# EAGLE design PCB-TLY-JACK-INTFC (EAGLE 6.4)
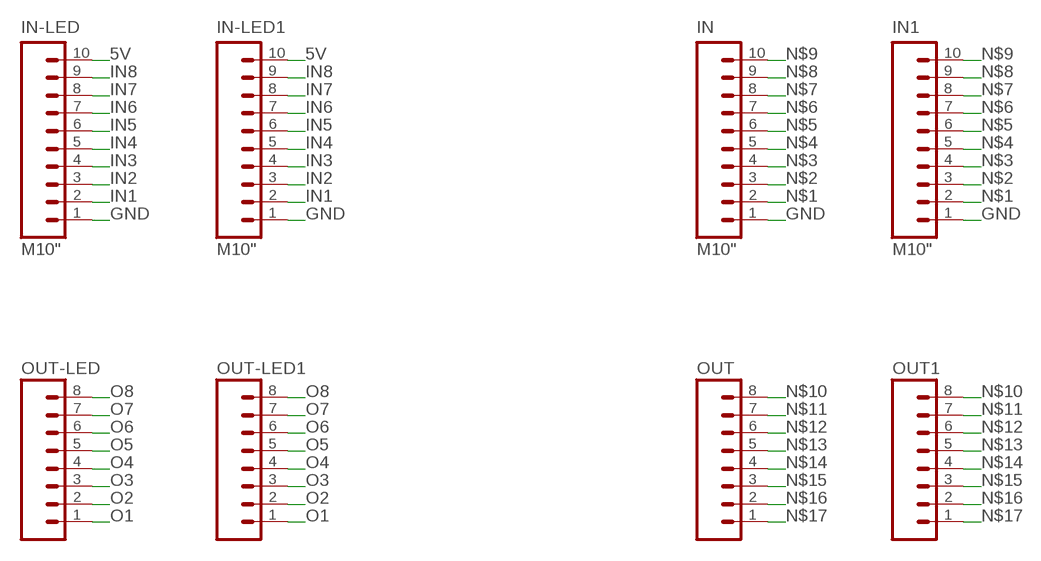
[diagram p0: schematic, sheet 1]

## Parts
IN  M10"  [1X10]
IN1  M10"  [1X10]
IN-LED  M10"  [1X10]
IN-LED1  M10"  [1X10]
OUT  M081X08  [1X08]
OUT1  M081X08  [1X08]
OUT-LED  M081X08  [1X08]
OUT-LED1  M081X08  [1X08]

## Nets
5V [Power]: IN-LED1.10 IN-LED.10
GND [Power]: IN1.1 IN-LED1.1 IN-LED.1 IN.1
IN1: IN-LED1.2 IN-LED.2
IN2: IN-LED1.3 IN-LED.3
IN3: IN-LED1.4 IN-LED.4
IN4: IN-LED1.5 IN-LED.5
IN5: IN-LED1.6 IN-LED.6
IN6: IN-LED1.7 IN-LED.7
IN7: IN-LED1.8 IN-LED.8
IN8: IN-LED1.9 IN-LED.9
N$1: IN1.2 IN.2
N$2: IN1.3 IN.3
N$3: IN1.4 IN.4
N$4: IN1.5 IN.5
N$5: IN1.6 IN.6
N$6: IN1.7 IN.7
N$7: IN1.8 IN.8
N$8: IN1.9 IN.9
N$9: IN1.10 IN.10
N$10: OUT1.8 OUT.8
N$11: OUT1.7 OUT.7
N$12: OUT1.6 OUT.6
N$13: OUT1.5 OUT.5
N$14: OUT1.4 OUT.4
N$15: OUT1.3 OUT.3
N$16: OUT1.2 OUT.2
N$17: OUT1.1 OUT.1
O1: OUT-LED1.1 OUT-LED.1
O2: OUT-LED1.2 OUT-LED.2
O3: OUT-LED1.3 OUT-LED.3
O4: OUT-LED1.4 OUT-LED.4
O5: OUT-LED1.5 OUT-LED.5
O6: OUT-LED1.6 OUT-LED.6
O7: OUT-LED1.7 OUT-LED.7
O8: OUT-LED1.8 OUT-LED.8

## Library data of the parts
IN IN1 IN-LED IN-LED1 = SparkFun:M10: Header 10 Standard 10-pin 0.1" header. Use with straight break away headers (SKU : PRT-00116), right angle break away headers (PRT-00553), swiss pins (PRT-00743), machine pins (PRT-00117), and female headers (PRT-00115).
OUT OUT1 OUT-LED OUT-LED1 = SparkFun:M08: Header 8 Standard 8-pin 0.1" header. Use with straight break away headers (SKU : PRT-00116), right angle break away headers (PRT-00553), swiss pins (PRT-00743), machine pins (PRT-00117), and female headers (PRT-00115).

## Net classes
0 default: width 0.203 mm, drill 0.406 mm, clearance 0.203 mm
1 Power: width 0.406 mm, drill 0.61 mm, clearance 0.203 mm
2 RELAY LINES: width 0.305 mm, drill 0.406 mm, clearance 0.254 mm
3 INput lines: width 0.203 mm, drill 0.406 mm, clearance 0.254 mm

## Board
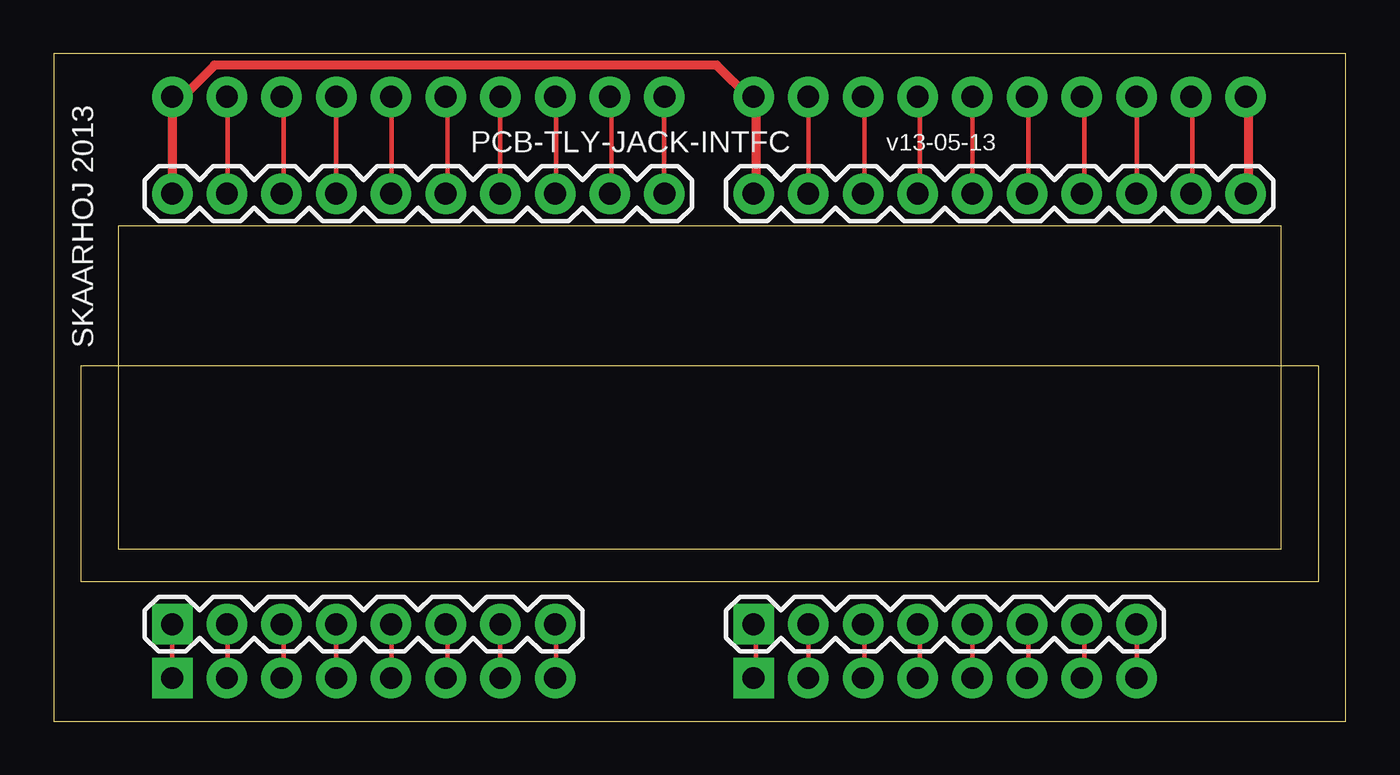
[diagram p1: board, top side]
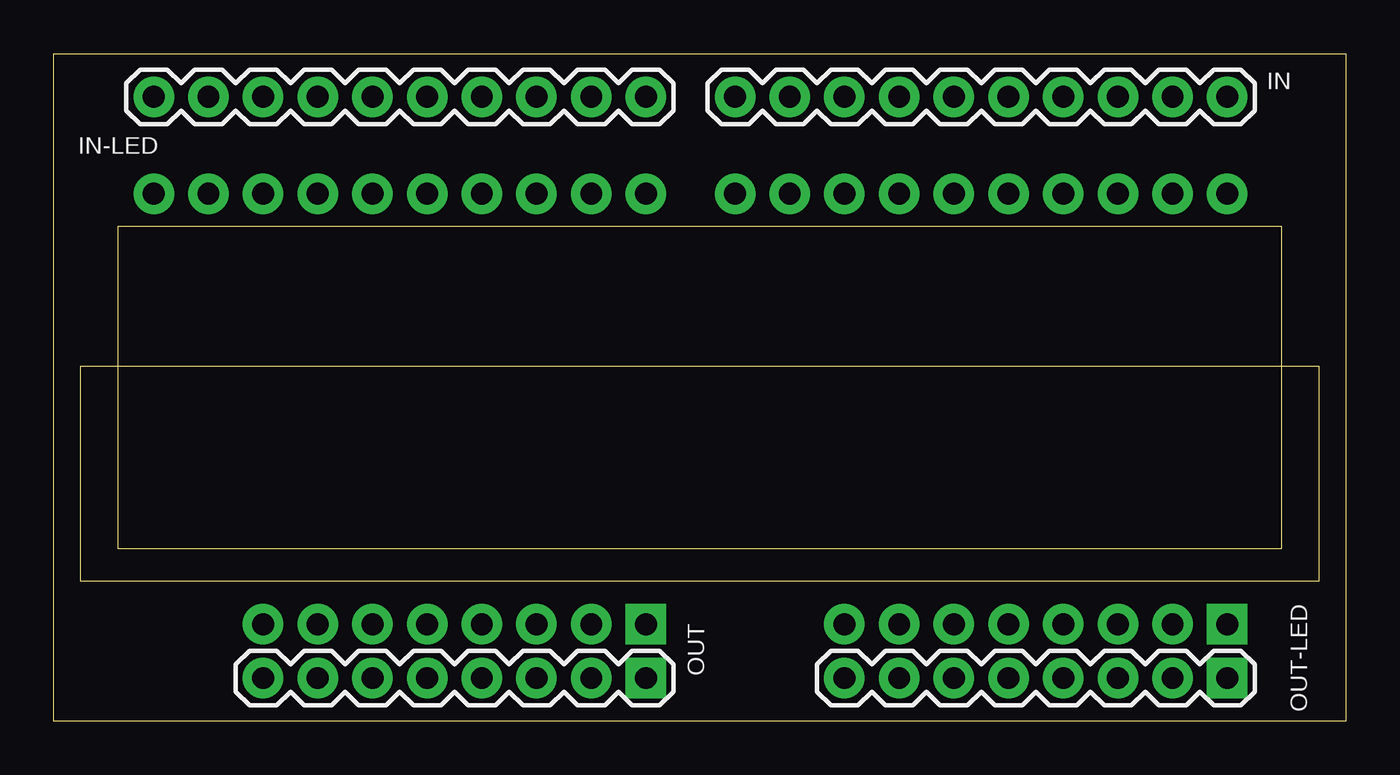
[diagram p2: board, bottom side, seen from below]

Size 60 x 31 mm. Coordinates in mm from the lower left corner, seen from the top.
Outline: 60,0 60,31 0,31 0,0 60,0
Copper layers (1*16): Top 0.035mm / dielectric 1.5mm / Bottom 0.035mm
Design rules "Fusion_eagle_rule_v1.1": minimum track width 6mil, minimum drill 12mil, track to track 6mil, track to pad 6mil, pad to pad 6mil, via to via 6mil, smd to smd 0mil, copper to edge 10mil, drill to drill 10mil, minimum pad ring 10mil, minimum via ring 6mil, stop-mask expansion 2mil, vias tented up to drill 100mil, thermal gap 10mil
tRestrict: area 2.7,7.7 to 57.3,23.3
bRestrict: area 2.7,7.7 to 57.3,23.3
Milling: area 3,8 to 57,23; area 1.2,6.5 to 58.8,16.5

### Footprints (pad centres in the part's own frame; a part is rotated, then mirrored left to right if it is on the bottom)
1X10 = drill 1.016 pad 1.88: 1 0,0; 2 2.54,0; 3 5.08,0; 4 7.62,0; 5 10.16,0; 6 12.7,0; 7 15.24,0; 8 17.78,0; 9 20.32,0; 10 22.86,0
1X08 = drill 1.016 pad 1.88 square: 1 0,0 | drill 1.016 pad 1.88: 2 2.54,0; 3 5.08,0; 4 7.62,0; 5 10.16,0; 6 12.7,0; 7 15.24,0; 8 17.78,0

### Placement (x,y rotation side)
IN  5.5,29 180 bottom
IN1  5.5,24.5 0 top
IN-LED  32.5,29 180 bottom
IN-LED1  32.5,24.5 0 top
OUT  32.5,2 180 bottom
OUT1  32.5,4.5 0 top
OUT-LED  5.5,2 180 bottom
OUT-LED1  5.5,4.5 0 top

### Tracks (layer width: path | path; a pad name or v marks a point on that pad's centre or on a via)
5V
  Top 0.406: IN-LED1.10 55.47,24.54 55.47,28.96 IN-LED.10
GND
  Top 0.406: IN1.1 5.49,24.54 5.49,28.96 IN.1 5.64,29.11 6.1,29.11 7.47,30.48 30.79,30.48 32.31,28.96 IN-LED.1 32.61,28.96 32.61,24.54 IN-LED1.1
IN1
  Top 0.203: IN-LED1.2 35.05,24.54 35.05,28.96 IN-LED.2
IN2
  Top 0.203: IN-LED1.3 37.64,24.54 37.64,28.96 IN-LED.3
IN3
  Top 0.203: IN-LED1.4 40.23,24.54 40.23,28.96 IN-LED.4
IN4
  Top 0.203: IN-LED1.5 42.67,24.54 42.67,28.96 IN-LED.5
IN5
  Top 0.203: IN-LED1.6 45.26,24.54 45.26,28.96 IN-LED.6
IN6
  Top 0.203: IN-LED1.7 47.85,24.54 47.85,28.96 IN-LED.7
IN7
  Top 0.203: IN-LED1.8 50.29,24.54 50.29,28.96 IN-LED.8
IN8
  Top 0.203: IN-LED1.9 52.88,24.54 52.88,28.96 IN-LED.9
N$1
  Top 0.203: IN1.2 8.08,24.54 8.08,28.96 IN.2
N$2
  Top 0.203: IN1.3 10.67,24.54 10.67,28.96 IN.3
N$3
  Top 0.203: IN1.4 13.11,24.54 13.11,28.96 IN.4
N$4
  Top 0.203: IN1.5 15.7,24.54 15.7,28.96 IN.5
N$5
  Top 0.203: IN1.6 18.29,24.54 18.29,28.96 IN.6
N$6
  Top 0.203: IN1.7 20.73,24.54 20.73,28.96 IN.7
N$7
  Top 0.203: IN1.8 23.32,24.54 23.32,28.96 IN.8
N$8
  Top 0.203: IN1.9 25.91,24.54 25.91,28.96 IN.9
N$9
  Top 0.203: IN1.10 28.35,24.54 28.35,28.96 IN.10
N$10
  Top 0.203: OUT.8 50.29,2.13 50.29,4.42 OUT1.8
N$11
  Top 0.203: OUT.7 47.85,2.13 47.85,4.42 OUT1.7
N$12
  Top 0.203: OUT.6 45.26,2.13 45.26,4.42 OUT1.6
N$13
  Top 0.203: OUT.5 42.67,2.13 42.67,4.42 OUT1.5
N$14
  Top 0.203: OUT.4 40.23,2.13 40.23,4.42 OUT1.4
N$15
  Top 0.203: OUT.3 37.64,2.13 37.64,4.42 OUT1.3
N$16
  Top 0.203: OUT.2 35.05,2.13 35.05,4.42 OUT1.2
N$17
  Top 0.203: OUT.1 32.61,2.13 32.61,4.42 OUT1.1
O1
  Top 0.203: OUT-LED.1 5.49,2.13 5.49,4.42 OUT-LED1.1
O2
  Top 0.203: OUT-LED.2 8.08,2.13 8.08,4.42 OUT-LED1.2
O3
  Top 0.203: OUT-LED.3 10.67,2.13 10.67,4.42 OUT-LED1.3
O4
  Top 0.203: OUT-LED.4 13.11,2.13 13.11,4.42 OUT-LED1.4
O5
  Top 0.203: OUT-LED.5 15.7,2.13 15.7,4.42 OUT-LED1.5
O6
  Top 0.203: OUT-LED.6 18.29,2.13 18.29,4.42 OUT-LED1.6
O7
  Top 0.203: OUT-LED.7 20.73,2.13 20.73,4.42 OUT-LED1.7
O8
  Top 0.203: OUT-LED.8 23.32,2.13 23.32,4.42 OUT-LED1.8

### Text on the board
_tsilk: v13-05-13 | PCB-TLY-JACK-INTFC | SKAARHOJ 2013